# Altium schematic sheet AQCA-Light-Control-CoolWhite-A0.SchDoc
size A4
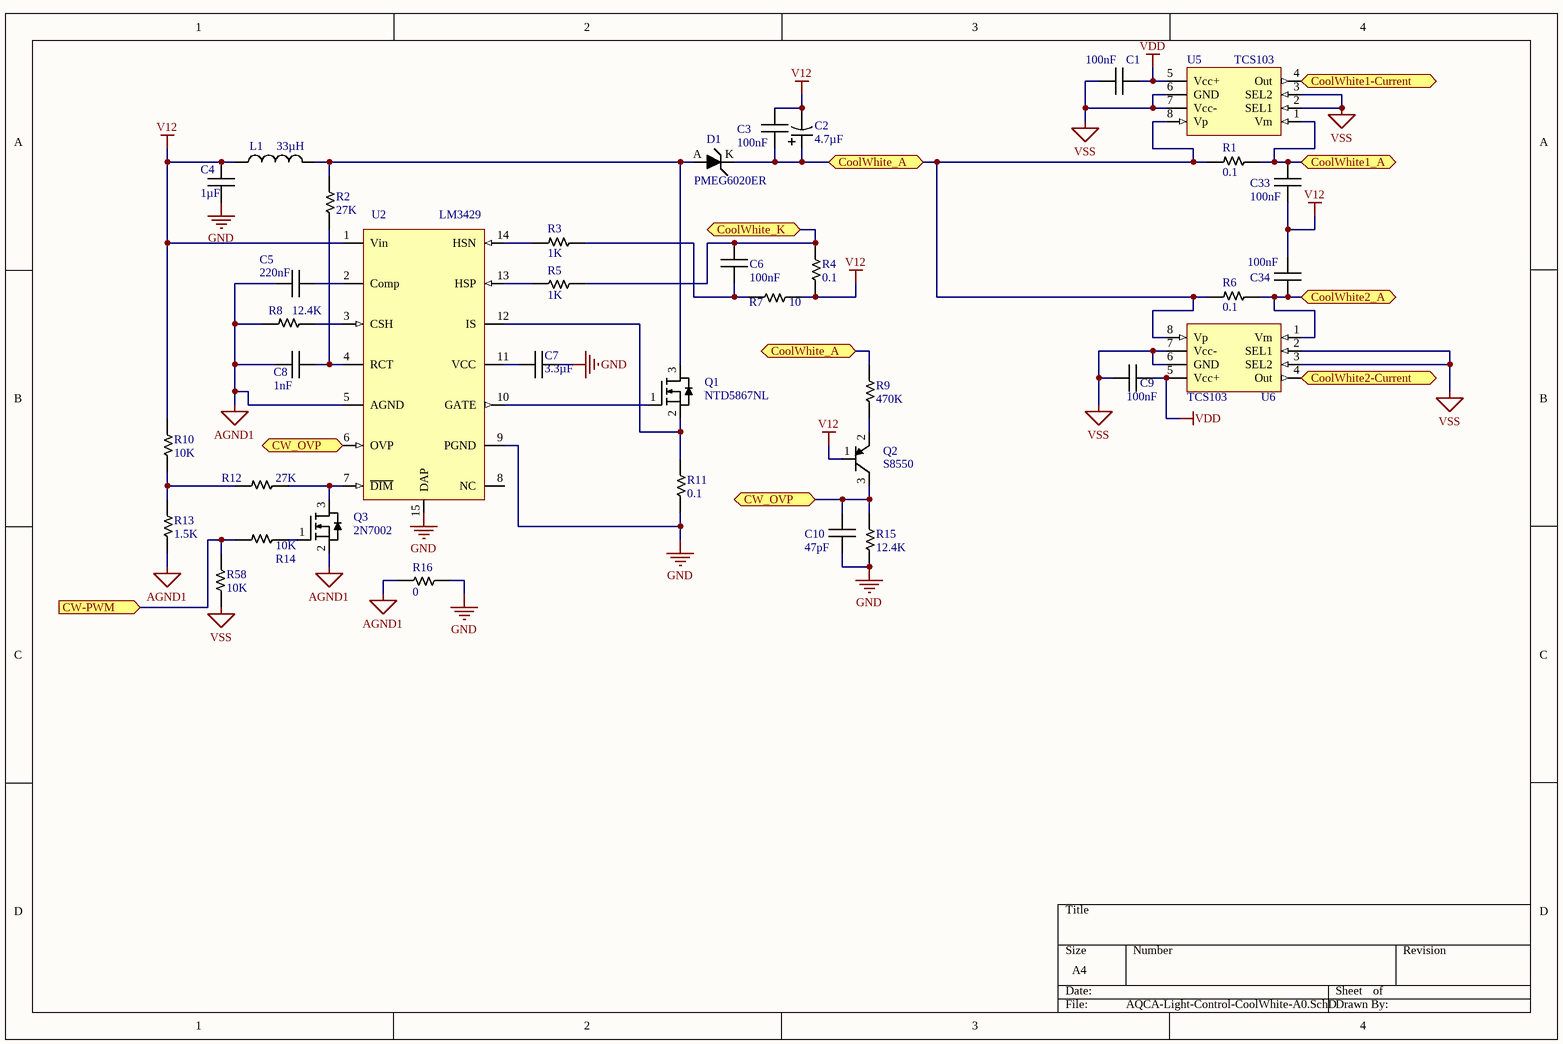
[diagram p0: AQCA-Light-Control-CoolWhite-A0.SchDoc]

## Parts
C1  100nF  [CAPC1608N]
C2  4.7µF  [CAPPR2-5x11]
C3  100nF  [CAPC2012N]
C4  1µF  [CAPC1608N]
C5  220nF  [CAPC1608N]
C6  100nF  [CAPC1608N]
C7  3.3µF  [CAPC1608N]
C8  1nF  [CAPC1608N]
C9  100nF  [CAPC1608N]
C10  47pF  [CAPC1608N]
C33  100nF  [CAPC2012N]
C34  100nF  [CAPC2012N]
D1  PMEG6020ER  [SOD123]
L1  33µH  [Inductor AIUR5-6]
Q1  NTD5867NL  [DPAK 369AA]
Q2  S8550  [SOT23_N]
Q3  2N7002  [SOT23-3N]
R1  0.1  [RESC2012N]
R2  27K  [RESC1608N]
R3  1K  [RESC1608N]
R4  0.1  [RESC2012N]
R5  1K  [RESC1608N]
R6  0.1  [RESC2012N]
R7  10  [RESC1608N]
R8  12.4K  [RESC1608N]
R9  470K  [RESC1608N]
R10  10K  [RESC1608N]
R11  0.1  [RESC6332N]
R12  27K  [RESC1608N]
R13  1.5K  [RESC1608N]
R14  10K  [RESC1608N]
R15  12.4K  [RESC1608N]
R16  0  [RESC1608N]
R58  10K  [RESC1608N]
U2  LM3429  [TSOP65P640_HS-14N]
U5  TCS103  [TSSOP8N_N]
U6  TCS103  [TSSOP8N_N]

## Ports
CoolWhite1-Current, CoolWhite1_A, CoolWhite2-Current, CoolWhite2_A, CoolWhite_A, CoolWhite_K, CW-PWM (in), CW_OVP

## Nets
AGND1: C5.1 C8.1 Q3.2(S) R8.2 R13.1 R16.1 U2.5(AGND)
GND: C4.1 C7.1 C10.1 R11.1 R15.1 R16.2 U2.9(PGND) U2.15(DAP)
V12: C2.2 C3.2 C4.2 C33.1 C34.2 L1.1 Q2.1(B) R4.1 R7.2 R10.2 U2.1(Vin)
VDD: C1.1 C9.1 U5.5(Vcc+) U6.5(Vcc+)
VSS: C1.2 C9.2 R58.2 U5.2(SEL1) U5.3(SEL2) U5.6(GND) U5.7(Vcc-) U6.2(SEL1) U6.3(SEL2) U6.6(GND) U6.7(Vcc-)
CoolWhite1-Current: U5.4(Out) ; port CoolWhite1-Current
CoolWhite1_A: C33.2 R1.1 U5.1(Vm) ; port CoolWhite1_A
CoolWhite2-Current: U6.4(Out) ; port CoolWhite2-Current
CoolWhite2_A: C34.1 R6.1 U6.1(Vm) ; port CoolWhite2_A
CoolWhite_A: C2.1 C3.1 D1.K(Kathode) R1.2 R6.2 R9.2 U5.8(Vp) U6.8(Vp) ; port CoolWhite_A
CoolWhite_K: C6.2 R4.2 R5.2 ; port CoolWhite_K
CW-PWM: R14.2 R58.1 ; port CW-PWM
CW_OVP: C10.2 Q2.3(C) R15.2 U2.6(OVP) ; port CW_OVP
NetC5_2: C5.2 U2.2(Comp)
NetC6_1: C6.1 R3.1 R7.1
NetC7_2: C7.2 U2.11(VCC)
NetC8_2: C8.2 R2.1 U2.4(RCT)
NetD1_A: D1.A(Anode) L1.2 Q1.3(D) R2.2
NetQ1_1: Q1.1(G) U2.10(GATE)
NetQ1_2: Q1.2(S) R11.2 U2.12(IS)
NetQ2_2: Q2.2(E) R9.1
NetQ3_1: Q3.1(G) R14.1
NetQ3_3: Q3.3(D) R12.1 U2.7(~{DIM})
NetR3_2: R3.2 U2.14(HSN)
NetR5_1: R5.1 U2.13(HSP)
NetR8_1: R8.1 U2.3(CSH)
NetR10_1: R10.1 R12.2 R13.2

Not connected (* = marked no-connect by the designer): U2 8(NC)

## Library data of the parts
C1 C6 C7 C9 = Capacitor: Voltage: 16V
  C1 C6 C9: Value: 100nF
  C7: Value: 3.3µF
C2 = Capacitor Polarised: Voltage: 100V; Value: 4.7µF
C3 C10 C33 C34 = Capacitor: Voltage: 100V
  C3 C33 C34: Value: 100nF
  C10: Value: 47pF
C4 C5 = Capacitor: Voltage: 25V
  C4: Value: 1µF
  C5: Value: 220nF
C8 = Capacitor: Voltage: 50V; Value: 1nF
D1 = Schottky Diode: pin to pad: A>1 K>2; Vf: 0.46V; Vr: 60V; If: 2A; Model: PMEG6020ER
L1 = Inductor: DC Current: 5.2A; Value: 33µH
Q1 = MOSFET N-Ch: pin to pad: 2>3 3>4; Vdss: 60V; Id: 20A; RdsON: 0.05; Model: NTD5867NL
Q2 = PNP: pin to pad: 1>3 3>1; Model: S8550
Q3 = MOSFET N-Ch: Vdss: 60V; Id: 115mA; RdsON: 7.5; Model: 2N7002
R1-R16 R58 = Resistor
  R1 R4 R6 R11: Value: 0.1
  R2 R12: Value: 27K
  R3 R5: Value: 1K
  R7: Value: 10
  R8 R15: Value: 12.4K
  R9: Value: 470K
  R10 R14 R58: Value: 10K
  R13: Value: 1.5K
  R16: Value: 0